# EAGLE design ohm4_ocxo (EAGLE 6.2)
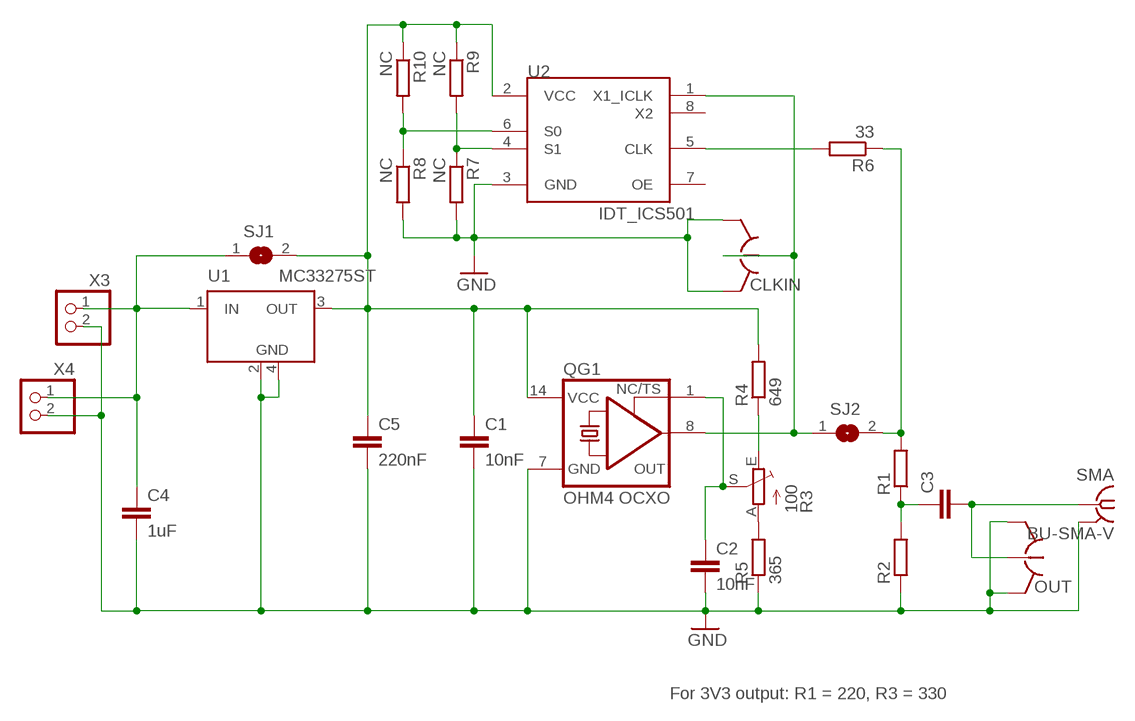
[diagram p0: schematic, sheet 1]

## Parts
C1  10nF  C-EUC0603  [C0603]
C2  10nF  C-EUC0603  [C0603]
C3  C-EUC0603  [C0603]
C4  1uF  C-EUC0603  [C0603]
C5  220nF  C-EUC0603  [C0603]
CLKIN  HRS_UFL  [HRS_UFL]
OUT  HRS_UFL  [HRS_UFL]
QG1  OHM4 OCXO  XO-14  [DIL14S]
R1  R-EU_R0603  [R0603]
R2  R-EU_R0603  [R0603]
R3  100  TRIM_EU-PTSPIN  [PT-SPIN]
R4  649  R-EU_R0603  [R0603]
R5  365  R-EU_R0603  [R0603]
R6  33  R-EU_R0603  [R0603]
R7  NC  R-EU_R0603  [R0603]
R8  NC  R-EU_R0603  [R0603]
R9  NC  R-EU_R0603  [R0603]
R10  NC  R-EU_R0603  [R0603]
SJ1  SJ  [SJ]
SJ2  SJ  [SJ]
SMA  BU-SMA-V  [BU-SMA-V]
U1  MC33275ST  [SOT223]
U2  IDT_ICS501  [SOIC08]
X3  PINHD-1X2  [1X02]
X4  PINHD-1X2  [1X02]

## Nets
GND [power]: C1.2 C2.2 C4.2 C5.2 CLKIN.GND@1(GND) CLKIN.GND@2(GND) OUT.GND@1(GND) OUT.GND@2(GND) QG1.7(GND) R2.1 R5.1 R7.2 R8.2 SMA.2(GND) U1.2(GND) U1.4(GND1) U2.3(GND) X3.2 X4.2
N$1: C3.1 R1.1 R2.2
N$3 [power]: C4.1 SJ1.1 U1.1(IN) X3.1 X4.1
N$4: R1.2 R6.1 SJ2.2
N$5: C2.1 QG1.1(TS) R3.S
N$6: CLKIN.SIG QG1.8(OUT) SJ2.1 U2.1(X1_ICLK)
N$7: R6.2 U2.5(CLK)
N$8: R7.1 R9.2 U2.4(S1)
N$9: R8.1 R10.2 U2.6(S0)
N$10: R3.A R5.2
N$11: R3.E R4.1
N$12: C3.2 OUT.SIG SMA.1
VCC [power]: C1.1 C5.1 QG1.14(VCC) R4.2 R9.1 R10.1 SJ1.2 U1.3(OUT) U2.2(VCC)
Unconnected: U2.7(OE) U2.8(X2)

## Notes on the sheet
- For 3V3 output: R1 = 220, R3 = 330

## Power pins joined to a net without a drawn wire
GND: SMA.3(GND) SMA.4(GND) SMA.5(GND)

## Library data of the parts
C1-C5 = rcl:C-EU: CAPACITOR, European symbol
CLKIN OUT = laforge:HRS_UFL: Hirose U.FL SMT
QG1 = crystal:XO-: CRYSTAL; OC_FARNELL: unknown; OC_NEWARK: unknown
R1 R2 R4-R10 = rcl:R-EU_: RESISTOR, European symbol
R3 = pot:TRIM_EU-: POTENTIOMETER
SJ1 SJ2 = jumper:SJ: SMD solder JUMPER
SMA = con-coax:BU-SMA-V: FEMALE SMA CONNECTOR Radiall distributor RS 112-3794; OC_FARNELL: unknown; OC_NEWARK: unknown
U1 = laforge:MC33275: ON Semiconductor MC33275 LDO
U2 = laforge:IDT_ICS501
X3 X4 = pinhead:PINHD-1X2: PIN HEADER

## Net classes
0 default: width 0.254 mm, drill 0.254 mm
1 power: width 0.508 mm, drill 0.508 mm

## Board
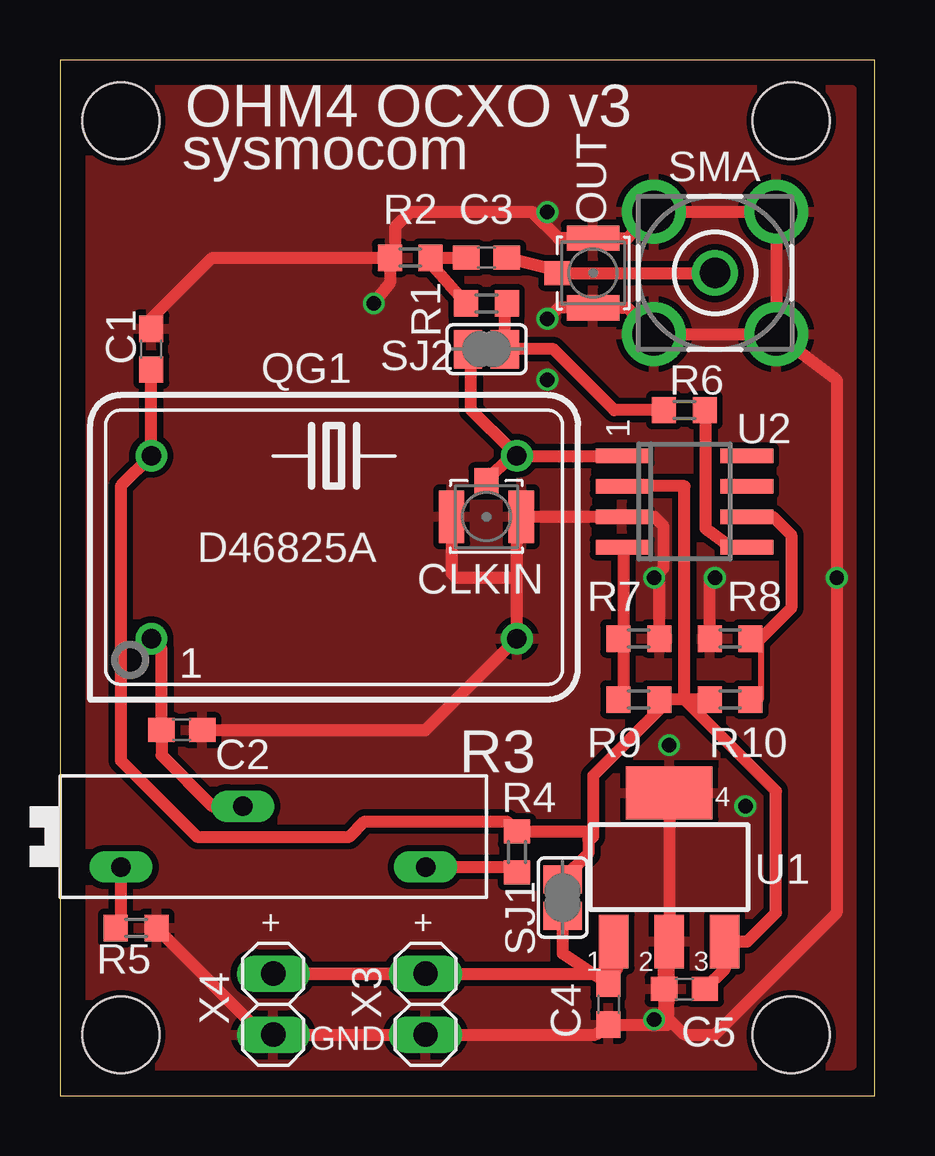
[diagram p1: board, top side]
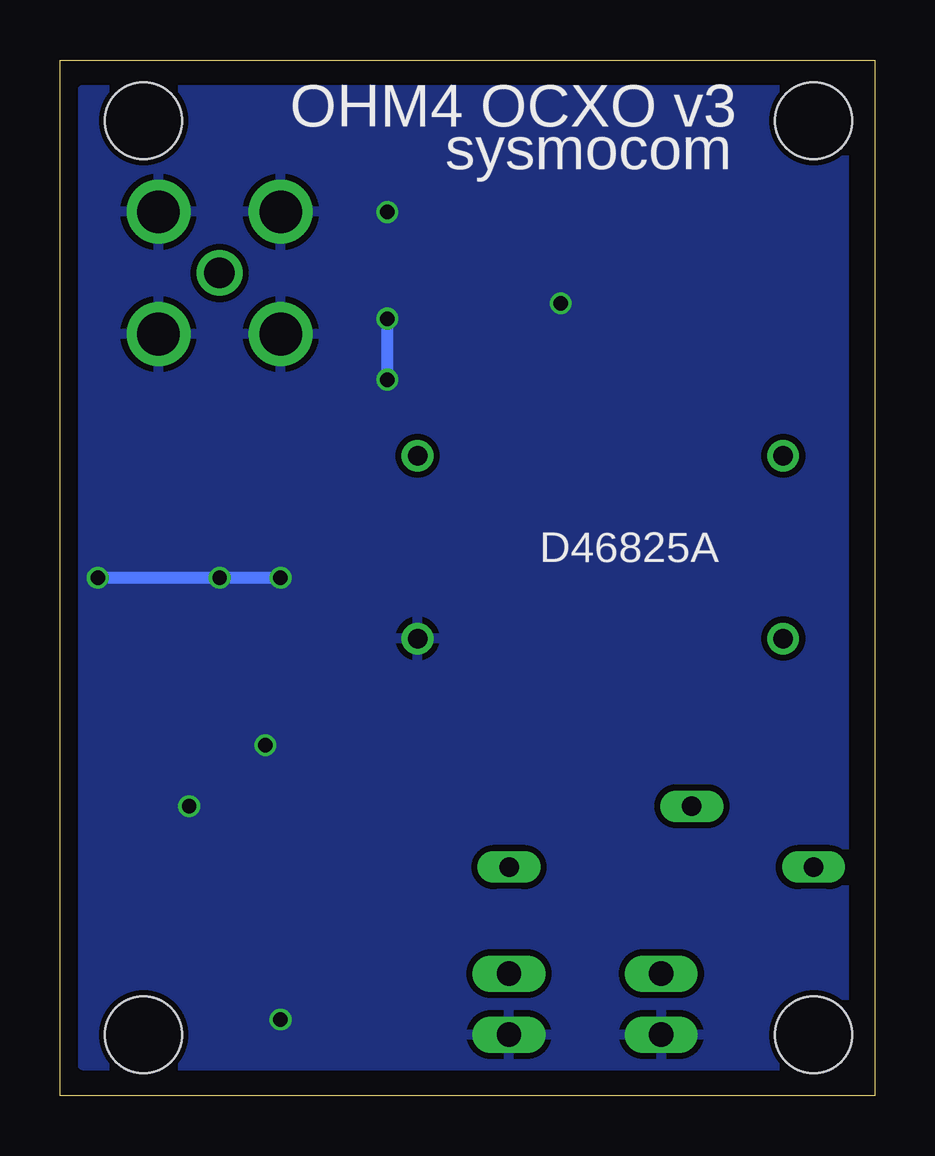
[diagram p2: board, bottom side, seen from below]

Size 33.96 x 43.17 mm. Coordinates in mm from the lower left corner, seen from the top.
Outline: 0,0 33.96,0 33.96,43.17 0,43.17 0,0
Copper layers (1*16): Top 0.035mm / dielectric 1.5mm / Bottom 0.035mm
Design rules: minimum track width 6mil, minimum drill 12mil, track to track 10mil, track to pad 10mil, pad to pad 10mil, via to via 6mil, smd to smd 0mil, copper to edge 10mil, drill to drill 10mil, minimum pad ring 10mil, minimum via ring 6mil, stop-mask expansion 2mil, vias tented up to drill 100mil, thermal gap 10mil
Holes 3.2 mm at 30.48,40.64 30.48,2.54 2.54,2.54 2.54,40.64

### Footprints (pad centres in the part's own frame; a part is rotated, then mirrored left to right if it is on the bottom)
C0603 = smd 1.1 x 1: 1 -0.85,0; 2 0.85,0
HRS_UFL = smd 1.05 x 2.2: GND@1 -1.452,0; GND@2 1.452,0 | smd 1 x 1.05: SIG 0,-1.502
DIL14S = drill 0.813: 1 -7.62,-3.81; 7 7.62,-3.81; 8 7.62,3.81; 14 -7.62,3.81
R0603 = smd 1 x 1.1: 1 -0.85,0; 2 0.85,0
PT-SPIN = drill 0.813 long: A -6.35,-1.27; E 6.35,-1.27; S -1.27,1.27
SJ = smd 1.168 x 1.6: 1 -0.762,0; 2 0.762,0
BU-SMA-V = drill 1.27: 1 0,0 | drill 1.778: 2 -2.55,2.55; 3 2.55,2.55; 4 2.55,-2.55; 5 -2.55,-2.55
SOT223 = smd 1.219 x 2.235: 1 -2.311,-3.099; 2 0,-3.099; 3 2.311,-3.099 | smd 3.6 x 2.2: 4 0,3.099
SOIC08 = smd 0.6 x 2.2: 1 -1.905,-2.6; 2 -0.635,-2.6; 3 0.635,-2.6; 4 1.905,-2.6; 5 1.905,2.6; 6 0.635,2.6; 7 -0.635,2.6; 8 -1.905,2.6
1X02 = drill 1.016 long: 1 -1.27,0; 2 1.27,0

### Placement (x,y rotation side)
C1  3.81,31.11 90 top
C2  5.08,15.24 0 top
C3  17.78,34.92 0 top
C4  22.86,3.81 270 top
C5  26.04,4.45 180 top
CLKIN  17.78,24.13 180 top
OUT  22.23,34.29 270 top
QG1  11.43,22.86 0 top
R1  17.78,33.02 0 top
R2  14.61,34.92 0 top
R3  8.89,10.79 0 top
R4  19.05,10.16 90 top
R5  3.17,6.99 180 top
R6  26.04,28.57 0 top
R7  24.13,19.05 0 top
R8  27.94,19.05 180 top
R9  24.13,16.51 180 top
R10  27.94,16.51 0 top
SJ1  20.95,8.26 90 top
SJ2  17.78,31.11 0 top
SMA  27.3,34.29 90 top
U1  25.4,9.53 0 top
U2  26.04,24.77 270 top
X3  15.24,3.81 270 top
X4  8.89,3.81 270 top

### Tracks (layer width: path | path; a pad name or v marks a point on that pad's centre or on a via)
GND  (via drill 0.6)
  Top 0.508: U1.2 25.18,6.01 C5.2 25.18,3.39 26.04,2.54 27.3,2.54 32.38,7.62 v32.38,21.59 32.38,29.84 SMA.5 | U1.2 25.36,2.96 C4.2 22.31,2.54 X3.2 X4.2 8.47,2.54 R5.1 | C1.2 3.81,32.38 6.35,34.92 R2.1 | SMA.5 SMA.4 SMA.3 23.66,35.74 OUT.GND@1 20.77,35.74 19.68,36.83 14.61,36.83 13.97,36.2 13.97,35.14 R2.1 | U1.4 U1.2 | 19.05,21.59 QG1.7 15.24,15.24 C2.2 | 19.05,21.59 19.05,23.95 CLKIN.GND@1 U2.3 24.77,24.13 25.15,23.75 25.15,21.97 v24.77,21.59 24.98,21.38 R7.2 | CLKIN.GND@2 16.33,21.77 16.51,21.59 19.05,21.59 | SMA.5 SMA.2 23.66,32.84 OUT.GND@2 20.77,32.84 v20.32,32.38 | R8.2 27.09,21.38 v27.3,21.59 | R2.1 13.76,33.87 v13.08,33.02
  Bottom 0.508: v32.38,21.59 v27.3,21.59 v24.77,21.59 | v20.32,32.38 v20.32,29.84
  other vias: 25.4,14.61 28.57,12.06 24.77,3.17 20.32,36.83
  pour Bottom: 1.27,41.91 33.02,41.91 33.02,1.27 1.27,1.27
  pour Top: 1.27,41.91 1.27,1.27 33.02,1.27 33.02,41.91
N$1
  Top 0.254: 15.24,34.92 R2.2
  Top 0.508: 15.24,34.92 R1.1 | R2.2 C3.1
N$3
  Top 0.508: X3.1 X4.1 23.07,5.08 C4.1 | C4.1 23.23,5.29 U1.1 | SJ1.1 20.95,5.93 C4.1
N$4
  Top 0.254: 18.54,32.93 R1.2
  Top 0.508: R6.1 23.11,28.57 20.57,31.11 SJ2.2 18.54,32.93
N$5
  Top 0.508: QG1.1 4.23,18.63 C2.1 4.23,14.19 6.35,12.06 R3.S
N$6
  Top 0.254: QG1.8 18.82,26.67 18.82,26.9 | 17.14,30.99 SJ2.1
  Top 0.508: QG1.8 U2.1 | 18.82,26.67 CLKIN.SIG | 18.82,26.9 17.14,28.57 17.14,30.99
N$7
  Top 0.254: U2.5 27.94,22.86 | 26.92,28.45 R6.2
  Top 0.508: 26.92,28.45 26.92,23.62 27.94,22.86
N$8
  Top 0.254: 23.5,16.51 R9.2 | 23.5,19.05 R7.1 | 23.5,22.86 U2.4
  Top 0.508: 23.5,16.51 23.5,19.05 23.5,22.86
N$9
  Top 0.254: R10.2 29.21,16.51 29.21,19.05 R8.1 | 29.72,24.13 U2.6
  Top 0.508: 29.21,19.05 30.48,20.32 30.48,23.37 29.72,24.13
N$10
  Top 0.254: 2.54,7.2 R5.2
  Top 0.508: R3.A 2.54,7.2
N$11
  Top 0.254: 18.84,9.53 R4.1
  Top 0.508: R3.E 18.84,9.53
N$12
  Top 0.254: 20.72,34.42 OUT.SIG | C3.2 20.45,34.42 20.95,34.29
  Top 0.508: C3.2 20.72,34.42 | 20.95,34.29 SMA.1
VCC
  Top 0.508: 3.81,30.48 C1.1 QG1.14 2.54,25.4 2.54,13.97 5.71,10.79 12.06,10.79 12.7,11.43 18.63,11.43 R4.2 22.01,11.01 22.23,10.79 | R10.1 26.04,16.51 | 26.04,16.51 R9.1 24.98,16.09 22.23,13.34 22.23,10.79 | U2.2 26.04,25.4 26.04,16.51 | C5.1 27.71,5.27 U1.3 28.65,6.43 29.84,7.62 29.84,12.7 26.04,16.51 | 22.02,10.87 22.02,10.67 | 22.02,10.67 22.02,10.08 SJ1.2 | 22.02,10.67 22.1,10.67 22.23,10.79

### Text on the board
tNames: OHM4 OCXO v3 | sysmocom | 1 | D46825A | + | + | GND
bNames: OHM4 OCXO v3 | sysmocom | D46825A